# EAGLE design minimega (EAGLE 6.4)
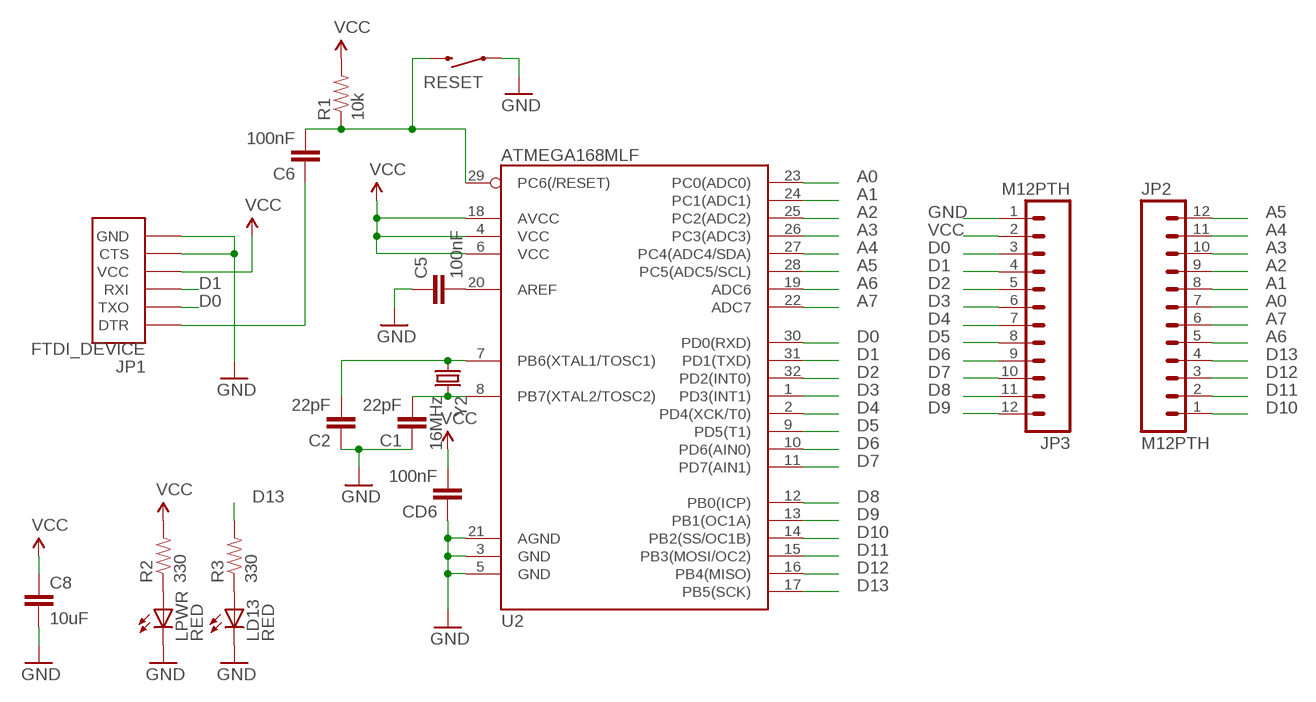
[diagram p0: schematic, sheet 1]

## Parts
C1  22pF  10NF-CER  [0402-CAP]
C2  22pF  10NF-CER  [0402-CAP]
C5  100nF  10NF-CER  [0402-CAP]
C6  100nF  10NF-CER  [0402-CAP]
C8  10uF  CAP0805  [0805]
CD6  100nF  10NF-CER  [0402-CAP]
JP1  FTDI_DEVICE  [FTDI_DEVICE_SIDE]
JP2  M12PTH  [1X12]
JP3  M12PTH  [1X12]
LD13  RED  LED-RED0603  [LED-0603]
LPWR  RED  LED-RED0603  [LED-0603]
R1  10k  RESISTOR0603  [0603-RES]
R2  330  RESISTOR0603  [0603-RES]
R3  330  RESISTOR0603  [0603-RES]
RESET  SWITCH-MOMENTARY-2PTH  [TACTILE-PTH]
U2  ATMEGA168MLF  [MLF32]
Y2  16MHz  CRYSTALSMD  [HC49UP]

## Nets
A0: JP2.7 U2.23(PC0(ADC0))
A1: JP2.8 U2.24(PC1(ADC1))
A2: JP2.9 U2.25(PC2(ADC2))
A3: JP2.10 U2.26(PC3(ADC3))
A4: JP2.11 U2.27(PC4(ADC4/SDA))
A5: JP2.12 U2.28(PC5(ADC5/SCL))
A6: JP2.5 U2.19(ADC6)
A7: JP2.6 U2.22(ADC7)
D0: JP1.P$2(TXO) JP3.3 U2.30(PD0(RXD))
D1: JP1.P$3(RXI) JP3.4 U2.31(PD1(TXD))
D2: JP3.5 U2.32(PD2(INT0))
D3: JP3.6 U2.1(PD3(INT1))
D4: JP3.7 U2.2(PD4(XCK/T0))
D5: JP3.8 U2.9(PD5(T1))
D6: JP3.9 U2.10(PD6(AIN0))
D7: JP3.10 U2.11(PD7(AIN1))
D8: JP3.11 U2.12(PB0(ICP))
D9: JP3.12 U2.13(PB1(OC1A))
D10: JP2.1 U2.14(PB2(SS/OC1B))
D11: JP2.2 U2.15(PB3(MOSI/OC2))
D12: JP2.3 U2.16(PB4(MISO))
D13: JP2.4 R3.2 U2.17(PB5(SCK))
GND: C1.1 C2.1 C5.1 C8.2 CD6.1 JP1.P$5(CTS) JP1.P$6(GND) JP3.1 LD13.C LPWR.C RESET.1 U2.3(GND) U2.5(GND) U2.21(AGND)
N$1: LD13.A R3.1
N$2: C1.2 U2.8(PB7(XTAL2/TOSC2)) Y2.2
N$3: C2.2 U2.7(PB6(XTAL1/TOSC1)) Y2.1
N$4: C5.2 U2.20(AREF)
N$24: C6.2 R1.1 RESET.3 U2.29(PC6(/RESET))
N$25: LPWR.A R2.1
N$26: C6.1 JP1.P$1(DTR)
VCC: C8.1 CD6.2 JP1.P$4(VCC) JP3.2 R1.2 R2.2 U2.4(VCC) U2.6(VCC) U2.18(AVCC)

## Library data of the parts
C1 C2 C5 C6 CD6 = SparkFun-Capacitors:10NF-CER: 10nF/.01uF/10000pF ceramic SMT CAP-00867- 50V 10% (0603); PROD_ID: CAP-00867; VALUE: 10nF
C8 = SparkFun-Capacitors:CAP: Capacitor Standard 0603 ceramic capacitor, and 0.1" leaded capacitor.
JP1 = SparkFun-Connectors:FTDI_DEVICE: Connector which mates to FTDI basic or FTDI cable.
JP2 JP3 = SparkFun-Connectors:M12: Header 12 Standard 12-pin 0.1" header. Use with straight break away headers (SKU : PRT-00116), right angle break away headers (PRT-00553), swiss pins (PRT-00743), machine pins (PRT-00117), and female headers (PRT-00115).
LD13 LPWR = SparkFun-LED:LED-RED: Assorted Red LEDs LilyPad 1206- DIO-09912 1206- DIO-00809 0603- DIO-00819; PROD_ID: DIO-00819
R1-R3 = SparkFun-Resistors:RESISTOR: Resistor Basic schematic elements and footprints for 0603, 1206, and PTH resistors.
RESET = SparkFun-Electromechanical:SWITCH-MOMENTARY-2: Various NO switches- pushbuttons, reed, etc
U2 = SparkFun-DigitalIC:ATMEGA168: Atmel 32-pin 8-bit micro, 16k flash.
Y2 = SparkFun-FreqCtrl:CRYSTAL: Various standard crystals. Proven footprints. Spark Fun Electronics SKU : COM-00534

## Board
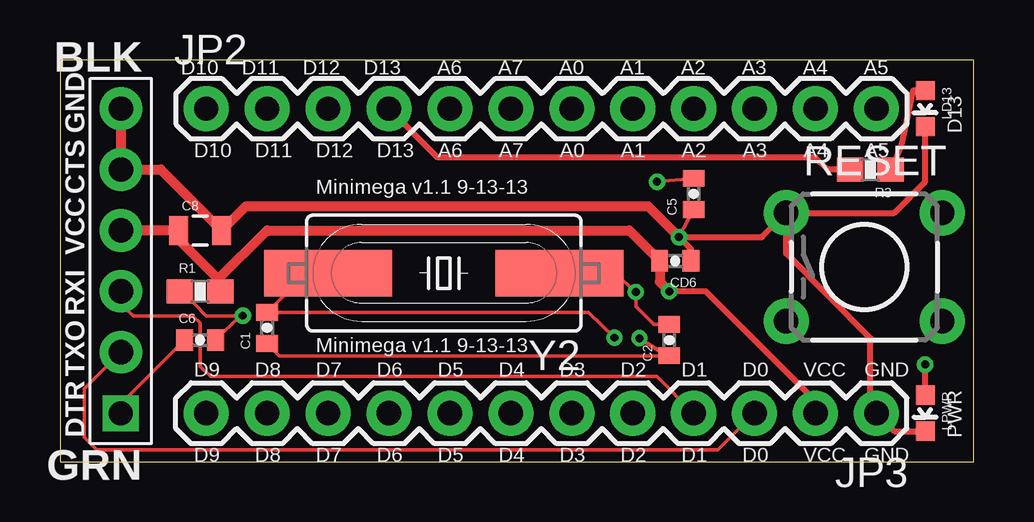
[diagram p1: board, top side]
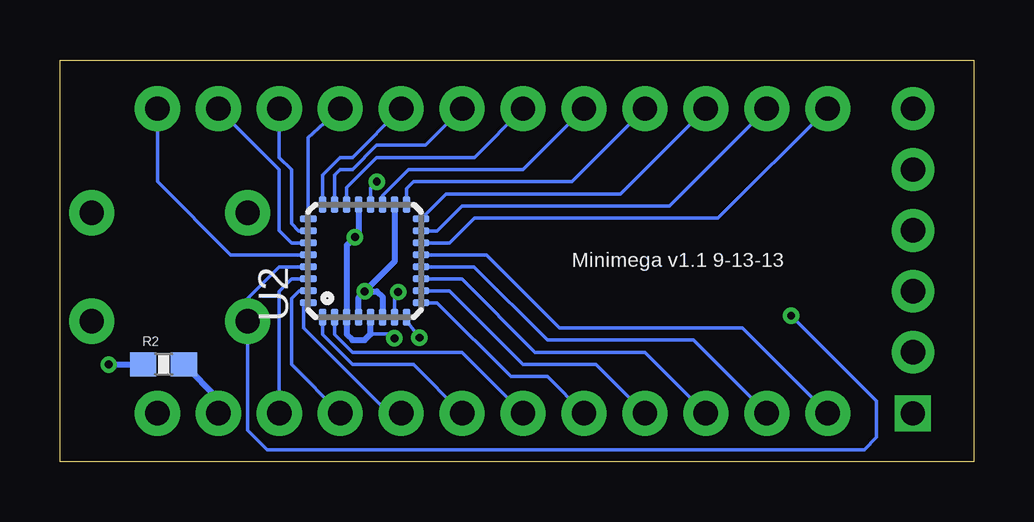
[diagram p2: board, bottom side, seen from below]

Size 38.1 x 16.76 mm. Coordinates in mm from the lower left corner, seen from the top.
Outline: 0,0 38.1,0 38.1,16.76 0,16.75 0,0
Copper layers (1*16): Top 0.0356mm / dielectric 1.5011mm / Bottom 0.0356mm
Design rules "OSHPark_mine": minimum track width 6mil, minimum drill 13mil, track to track 6mil, track to pad 6mil, pad to pad 6mil, via to via 6mil, smd to smd 6mil, copper to edge 15mil, drill to drill 6mil, minimum pad ring 7mil, minimum via ring 7mil, stop-mask expansion 2mil, vias tented up to drill 13mil, thermal gap 10mil

### Footprints (pad centres in the part's own frame; a part is rotated, then mirrored left to right if it is on the bottom)
0402-CAP = smd 0.7 x 0.9: 1 -0.65,0; 2 0.65,0
0805 = smd 0.8 x 1.2: 1 -0.9,0; 2 0.9,0
FTDI_DEVICE_SIDE = drill 1 square: P$1 -6.35,0 | drill 1.016 pad 1.778: P$2 -3.81,0; P$3 -1.27,0; P$4 1.27,0; P$5 3.81,0; P$6 6.35,0
1X12 = drill 1.016 pad 1.88: 1 0,0; 2 2.54,0; 3 5.08,0; 4 7.62,0; 5 10.16,0; 6 12.7,0; 7 15.24,0; 8 17.78,0; 9 20.32,0; 10 22.86,0; 11 25.4,0; 12 27.94,0
LED-0603 = smd 0.8 x 0.8: A 0,-0.75; C 0,0.75
0603-RES = smd 1.1 x 1: 1 -0.85,0; 2 0.85,0
TACTILE-PTH = drill 1.016 pad 1.88: 1 -3.251,2.261; 2 3.251,2.261; 3 -3.251,-2.261; 4 3.251,-2.261
MLF32 = smd 0.7 x 0.3: 1 -2.35,1.75; 2 -2.35,1.25; 3 -2.35,0.75; 4 -2.35,0.25; 5 -2.35,-0.25; 6 -2.35,-0.75; 7 -2.35,-1.25; 8 -2.35,-1.75; 17 2.35,-1.75; 18 2.35,-1.25; 19 2.35,-0.75; 20 2.35,-0.25; 21 2.35,0.25; 22 2.35,0.75; 23 2.35,1.25; 24 2.35,1.75 | smd 0.3 x 0.7: 9 -1.75,-2.35; 10 -1.25,-2.35; 11 -0.75,-2.35; 12 -0.25,-2.35; 13 0.25,-2.35; 14 0.75,-2.35; 15 1.25,-2.35; 16 1.75,-2.35; 25 1.75,2.35; 26 1.25,2.35; 27 0.75,2.35; 28 0.25,2.35; 29 -0.25,2.35; 30 -0.75,2.35; 31 -1.25,2.35; 32 -1.75,2.35
HC49UP = smd 5.334 x 1.93: 1 -4.826,0; 2 4.826,0

### Placement (x,y rotation side)
C1  8.64,5.59 90 top
C2  25.4,5.08 90 top
C5  26.42,11.18 90 top
C6  5.84,5.08 0 top
C8  5.84,9.65 0 top
CD6  25.65,8.38 180 top
JP1  2.54,8.38 90 top
JP2  6.1,14.73 0 top
JP3  34.04,2.03 180 top
LD13  36.07,14.73 180 top
LPWR  36.07,2.03 180 top
R1  5.84,7.11 0 top
R2  33.78,4.06 0 bottom
R3  33.78,12.19 180 top
RESET  33.53,8.13 0 top
U2  25.4,8.38 90 bottom
Y2  16,7.87 180 top

### Tracks (layer width: path | path; a pad name or v marks a point on that pad's centre or on a via)
A0
  Bottom 0.152: U2.23 26.65,11.96 26.42,12.19 25.91,12.19 24.89,13.21 22.86,13.21 JP2.7
A1
  Bottom 0.152: U2.24 27.15,11.97 26.42,12.7 25.91,12.7 JP2.8
A2
  Bottom 0.152: U2.25 27.75,13.53 JP2.9
A3
  Bottom 0.152: JP2.10 28.96,12.7 28.45,12.19 28.45,9.93 28.15,9.63 U2.26
A4
  Bottom 0.152: U2.27 28.44,9.13 28.96,9.65 28.96,12.19 JP2.11
A5
  Bottom 0.152: U2.28 30.98,8.63 34.04,11.68 JP2.12
A6
  Bottom 0.152: U2.19 24.65,11.11 23.57,12.19 18.8,12.19 JP2.5
A7
  Bottom 0.152: U2.22 26.15,11.44 24.89,12.7 20.83,12.7 JP2.6
D0
  Top 0.152: JP1.P$2 1.02,3.05 1.02,1.02 1.52,0.51 27.43,0.51 JP3.3
  Bottom 0.152: JP3.3 28.96,7.11 28.45,7.62 27.76,7.62 U2.30
D1
  Top 0.152: JP3.4 24.89,3.56 6.27,3.56 5.84,3.99 5.84,5.79 5.54,6.1 3.05,6.1 2.54,6.6 JP1.P$3
  Bottom 0.152: JP3.4 28.45,4.06 28.45,6.81 28.12,7.13 U2.31
D2
  Bottom 0.152: JP3.5 24.38,2.03 27.94,5.59 27.94,6.44 U2.32
D3
  Bottom 0.152: U2.1 27.15,5.31 25.91,4.06 23.37,4.06 JP3.6
D4
  Bottom 0.152: U2.2 26.65,5.31 25.91,4.57 21.34,4.57 JP3.7
D5
  Bottom 0.152: JP3.8 17.78,3.56 19.3,3.56 22.38,6.63 U2.9
D6
  Bottom 0.152: U2.10 21.86,7.13 18.8,4.06 15.75,4.06 JP3.9
D7
  Bottom 0.152: U2.11 21.35,7.63 18.29,4.57 13.72,4.57 JP3.10
D8
  Bottom 0.152: U2.12 20.83,8.13 17.78,5.08 11.68,5.08 JP3.11
D9
  Bottom 0.152: U2.13 20.32,8.63 17.27,5.59 9.65,5.59 JP3.12
D10
  Bottom 0.152: U2.14 21.86,9.13 20.83,10.16 10.67,10.16 JP2.1
D11
  Bottom 0.152: U2.15 22.37,9.63 21.34,10.67 12.7,10.67 JP2.2
D12
  Bottom 0.152: JP2.3 14.73,11.18 22.01,11.18 U2.16
D13
  Top 0.254: R3.2 32,12.19 31.5,12.7 15.75,12.7 JP2.4
  Bottom 0.152: U2.17 23.65,11.4 23.37,11.68 16.76,11.68 JP2.4
GND  (via drill 0.33)
  Top 0.152: C5.1 v25.81,9.37 | C1.1 9.14,4.43 C2.1 25.31,4.43 v24.16,5.16
  Top 0.254: CD6.1 26.3,8.88 v25.81,9.37 29.26,9.37 RESET.1 | RESET.1 30.28,8.69 33.78,5.16 33.78,2.26 JP3.1 34.79,1.28 LPWR.C | RESET.1 34.77,10.39 36.07,11.68 LD13.C
  Top 0.406: JP1.P$6 JP1.P$5 4.2,12.19 C8.2 7.76,10.67 24.51,10.67 v25.81,9.37
  Bottom 0.152: 25.65,9.53 v25.81,9.37 | v24.16,5.16 24.33,5.33 25.15,5.33
  Bottom 0.254: v25.81,9.37 26.15,9.03 U2.3 26.15,5.32 25.91,5.08 25.4,5.08 25.15,5.33 U2.5 | U2.21 25.65,9.53
N$1
  Top 0.254: LD13.A 35.56,15.48 35.05,13.12 R3.1
N$2  (via drill 0.33)
  Top 0.152: Y2.2 10.27,7.87 C1.2 22.03,6.24 v23.11,5.18
  Bottom 0.152: U2.8 23.65,5.87 v23.11,5.18
N$3  (via drill 0.33)
  Top 0.152: C2.2 24.75,5.73 24,6.48 v24,7.09 23.11,7.87 Y2.1
  Bottom 0.152: U2.7 24.15,6.94 v24,7.09
N$4  (via drill 0.33)
  Top 0.152: C5.2 v24.89,11.68
  Bottom 0.152: v24.89,11.68 25.15,11.43 U2.20
N$24  (via drill 0.33)
  Top 0.152: C6.2 7.51,6.1 v7.62,6.1 6.1,6.1 5.59,6.6 R1.1
  Bottom 0.152: U2.29 28.96,8.13 30.28,6.81 RESET.3 30.28,1.32 29.46,0.51 4.57,0.51 4.06,1.02 4.06,2.54 v7.62,6.1
N$25  (via drill 0.33)
  Top 0.254: LPWR.A v36.07,4.06
  Bottom 0.254: v36.07,4.06 R2.1
N$26
  Top 0.152: JP1.P$1 2.65,2.54 C6.1
VCC  (via drill 0.33)
  Top 0.254: 25.29,7 v25.4,7.11 26.92,7.11 31.5,2.54 JP3.2
  Top 0.406: v25.4,7.11 25,7.51 CD6.2 23.73,9.65 8.64,9.65 6.6,7.62 | JP1.P$4 C8.1 4.94,9.28 6.6,7.62 | 6.6,7.62 6.6,7.2 R1.2
  Bottom 0.254: U2.4 25.65,6.86 v25.4,7.11 | v25.4,7.11 24.89,7.11 24.65,6.87 U2.6 | U2.18 24.15,8.36 v25.4,7.11 | R2.2 31.5,2.63 JP3.2

### Text on the board
tPlace: D10 | D11 | D12 | D13 | A6 | A7 | A0 | A1 | A2 | A3 | A4 | A5 | D13 | D10 | D11 | D12 | D13 | A6 | A7 | A0 | A1 | A2 | A3 | A4 | A5 | Minimega v1.1 9-13-13 | Minimega v1.1 9-13-13 | D9 | D8 | D7 | D6 | D5 | D4 | D3 | D2 | D1 | D0 | VCC | GND | PWR | D9 | D8 | D7 | D6 | D5 | D4 | D3 | D2 | D1 | D0 | VCC | GND
bPlace: Minimega v1.1 9-13-13